# Altium project Flight_Controller.PrjPcb (part 1 of 4)
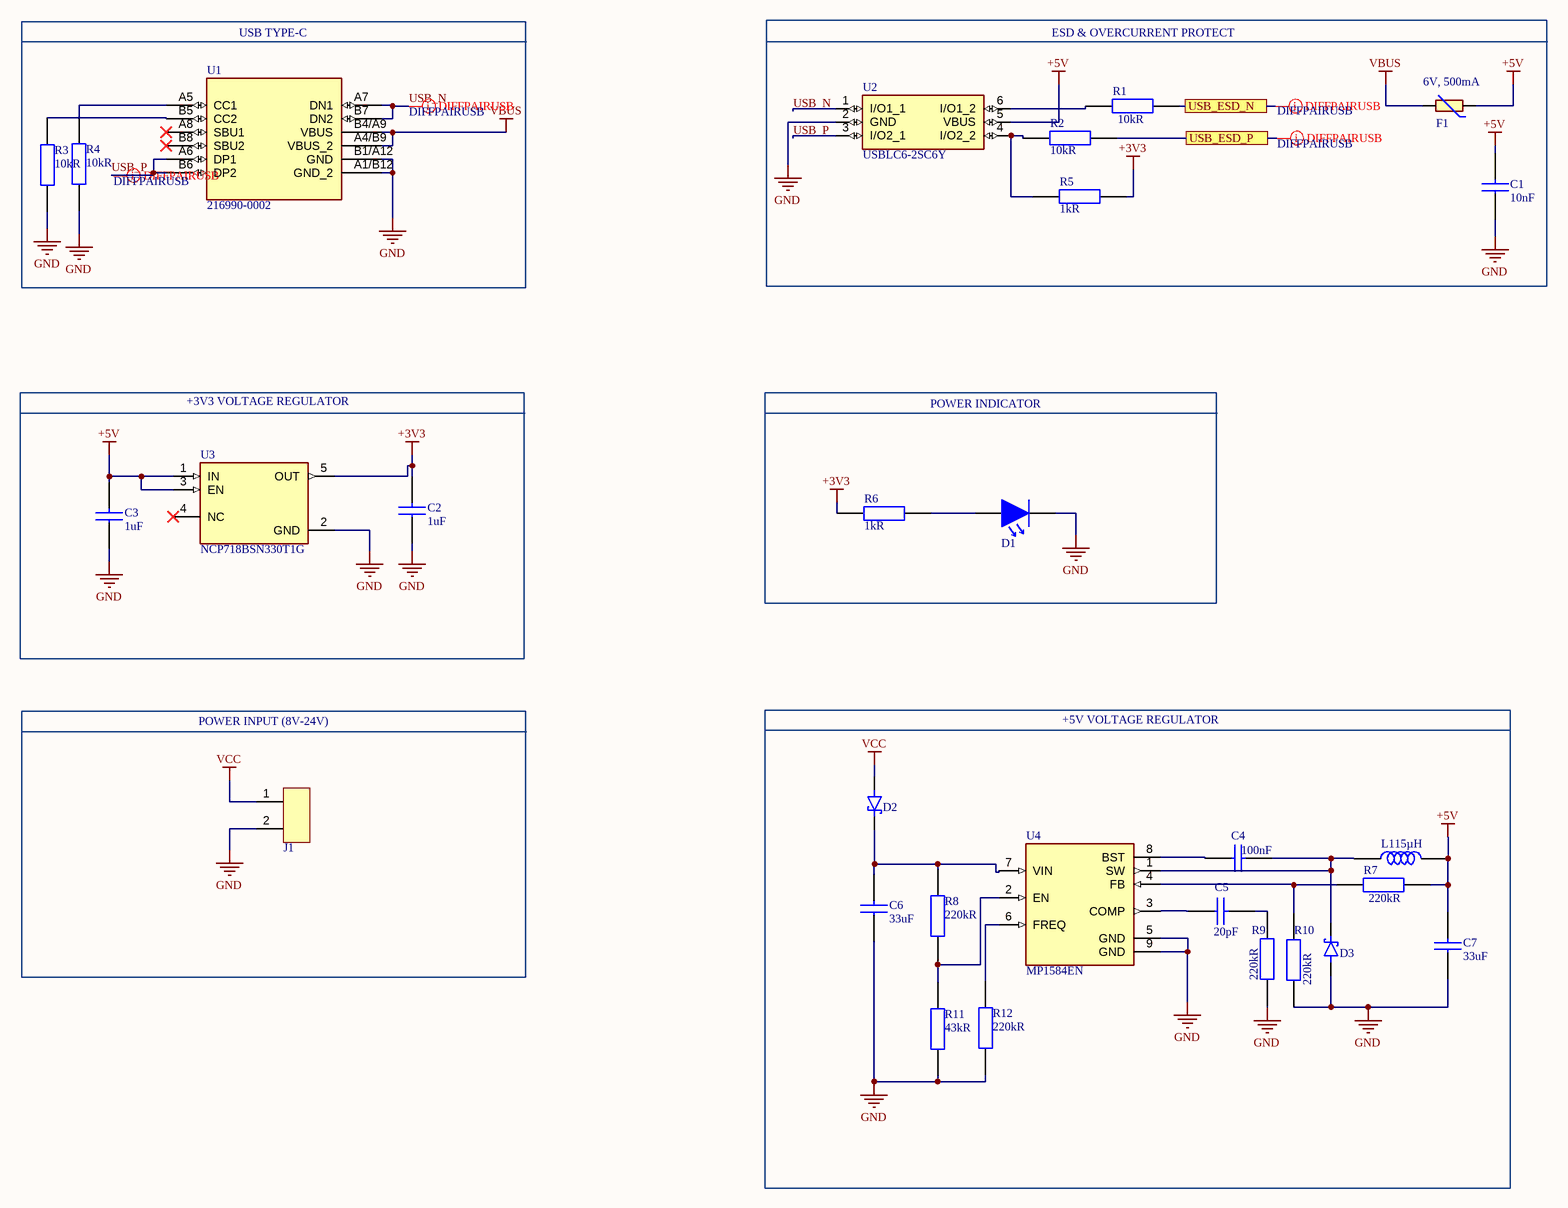
[diagram p0: POWER.SchDoc]
3 sheets, 95 parts. Net scope: flat (ports and power ports of the same name join across sheets).
Board file: Flight_Controller.PcbDoc
Sheets:
  POWER.SchDoc
  MICROCONTROLLER.SchDoc
  MODULES.SchDoc

## Sheet POWER.SchDoc
size 420 x 297 mm; SheetNumber: 1; SheetTotal: 3

### Parts
C1  Capacitance: 10nF  [CAP_0603]  (hidden comment: 0603B103K160CT)
C2  Capacitance: 1uF  [CAP_0805]  (hidden comment: CL21B105KBFNNNE)
C3  Capacitance: 1uF  [CAP_0805]  (hidden comment: CL21B105KBFNNNE)
C4  Capacitance: 100nF  [CAP_0603]  (hidden comment: C0603C104K5RACTU)
C5  Capacitance: 20pF  [CAP_0603]  (hidden comment: CL10C200JB8NNNC)
C6  Capacitance: 33uF  [CAP_1206]  (hidden comment: C3216X5R1E336M160AC)
C7  Capacitance: 33uF  [CAP_1206]  (hidden comment: C3216X5R1E336M160AC)
D1  LH R974-LP-1  [LED_RED_0805]  (value not drawn)
D2  MBRS320  [DIOM7959]  (value not drawn)
D3  B340A-13F  [DIOM522]  (value not drawn)
F1  FUSE_PTC  [FUSE_0603]  (value not drawn)
J1  TBP01R1-508-02BE  [TBP01R1-508]  (value not drawn)
L1  Inductance: 15µH  [INDM868]  (hidden comment: IND 15uH 3232)
R1  Resistance: 10kR  [RES_0603]  (hidden comment: RC0603FR-0710KL)
R2  Resistance: 10kR  [RES_0603]  (hidden comment: RC0603FR-0710KL)
R3  Resistance: 10kR  [RES_0603]  (hidden comment: RC0603FR-0710KL)
R4  Resistance: 10kR  [RES_0603]  (hidden comment: RC0603FR-0710KL)
R5  Resistance: 1kR  [RES_0603]  (hidden comment: RC0603FR-0710KL)
R6  Resistance: 1kR  [RES_0603]  (hidden comment: RC0603FR-0710KL)
R7  Resistance: 220kR  [RES_0603]  (hidden comment: RC0603JR-07220KL)
R8  Resistance: 220kR  [RES_0603]  (hidden comment: RC0603JR-07220KL)
R9  Resistance: 220kR  [RES_0603]  (hidden comment: RC0603JR-07220KL)
R10  Resistance: 220kR  [RES_0603]  (hidden comment: RC0603JR-07220KL)
R11  Resistance: 43kR  [RES_0603]  (hidden comment: RC0603JR-0743KL)
R12  Resistance: 220kR  [RES_0603]  (hidden comment: RC0603JR-07220KL)
U1  Supplier Part Number 1: 216990-0002  [USB_2169900002]  (hidden comment: USB_C 24PIN)
U2  Supplier Part Number 1: USBLC6-2SC6Y  [SOT-23-6]  (hidden comment: USB_LC62)
U3  Supplier Part Number 1: NCP718BSN330T1G  [SOT95-P]  (hidden comment: NCP718B)
U4  MP1584EN  [SOIC127]

### Blocks framed on the sheet
USB TYPE-C: R3 R4 U1
+3V3 VOLTAGE REGULATOR: C2 C3 U3
POWER INDICATOR: D1 R6
POWER INPUT (8V-24V): J1
+5V VOLTAGE REGULATOR: C4-C7 D2 D3 L1 R7-R12 U4

### Ports
USB_ESD_N (see MICROCONTROLLER[2B]), USB_ESD_P (see MICROCONTROLLER[2B])

### Nets
+3V3: C2.2 R5.2 R6.2 U3.5(OUT)
+5V: C1.2 C3.2 C7.2 F1.1 L1.2 R7.2 U2.5(VBUS) U3.1(IN) U3.3(EN)
GND: C1.1 C2.1 C3.1 C6.1 C7.1 D1.1 D3.A J1.2 R3.1 R4.1 R9.2 R10.1 R11.1 R12.1 U1.A1/B12(GND_2) U1.B1/A12(GND) U2.2(GND) U3.2(GND) U4.5(GND) U4.9(GND)
VBUS: F1.2 U1.A4/B9(VBUS_2) U1.B4/A9(VBUS)
VCC: D2.A J1.1
USB_N: U1.A7(DN1) U1.B7(DN2) U2.1(I/O1_1)
USB_P: U1.A6(DP1) U1.B6(DP2) U2.3(I/O2_1)
NetC4_1: C4.1 U4.8(BST)
NetC4_2: C4.2 D3.C L1.1 U4.1(SW)
NetC5_1: C5.1 U4.3(COMP)
NetC5_2: C5.2 R9.1
NetC6_2: C6.2 D2.C(K) R8.2 U4.7(VIN)
NetD1_2: D1.2 R6.1
NetR1_1: R1.1 U2.6(I/O1_2)
NetR1_2: R1.2 ; port USB_ESD_N
NetR2_1: R2.1 R5.1 U2.4(I/O2_2)
NetR2_2: R2.2 ; port USB_ESD_P
NetR3_2: R3.2 U1.B5(CC2)
NetR4_2: R4.2 U1.A5(CC1)
NetR7_1: R7.1 R10.2 U4.4(FB)
NetR8_1: R8.1 R11.2 U4.2(EN)
NetR12_2: R12.2 U4.6(FREQ)

Not connected (* = marked no-connect by the designer): U1 A8(SBU1)* B8(SBU2)*; U3 4(NC)*

### Layout directives
differential pair; differential pair class DIFFPAIRUSB: NetR1_2, NetR2_2, USB_N, USB_P

### Notes on the sheet
- ESD & OVERCURRENT PROTECT
- (near F1) 6V, 500mA
- THIS DOCUMENT AND THE DATA DISCLOSED HEREIN OR
- HEREWITH IS THE PROPERTY OF ALTIUM LIMITED AND MAY
- DWG NO:
- REVISION
- REV:
- DESCRIPTION
- DATE
- APPROVED
- BE FREELY DISTRIBUTED IN WHOLE. NO RIGHTS ARE
- RESERVED OR EXPRESS OR IMPLIED WARANTEE GIVEN.
- ENG:
- APPROVALS
- PROJECT
- DSN:
- CHK:
- REFERENCE DOCUMENTS
- PROJECT REVISION:
- TITLE
- DOCUMENT REVISION:
- DESIGN ITEM:
- BOM:
- FAB DWG:
- PCB DWG:
- ASSY DWG:
- SCALE:
- A3
- SIZE
- CAGE CODE
- FILE NAME
- DWG NO.
- SHEET
- OF
- REV